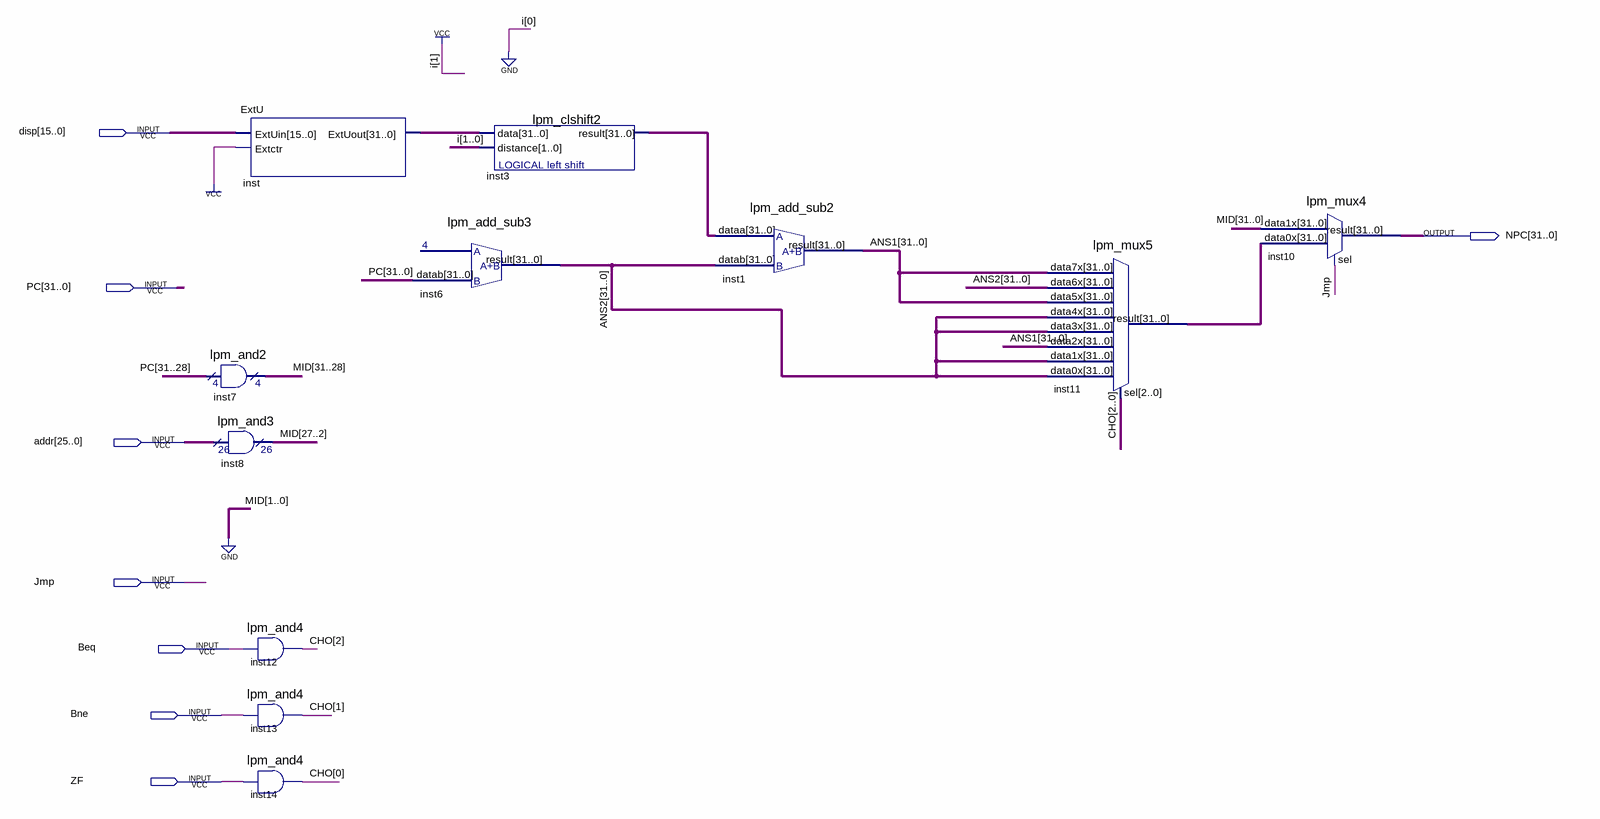
[diagram p0: schematic sheet]
// Quartus schematic ACU.bdf as structural Verilog: 11 symbols, 8 pins
module ACU (
  input  [15:0] disp,
  input  [31:0] PC,
  input  [25:0] addr,
  input  Jmp,
  input  Beq,
  input  Bne,
  input  ZF,
  output [31:0] NPC
);

  wire [2:0] CHO;
  wire [31:0] ANS1, ANS2, inst3_result, inst11_result, inst_extuout;
  wire [31:2] MID;

  lpm_and2 inst7 (.data0x(PC[31:28]), .result(MID[31:28]));
  lpm_and3 inst8 (.data0x(addr), .result(MID[27:2]));
  ExtU inst (.ExtUin(disp), .Extctr(1'b1), .ExtUout(inst_extuout));
  lpm_and4 inst12 (.data0(Beq), .result(CHO[2]));
  lpm_and4 inst13 (.data0(Bne), .result(CHO[1]));
  lpm_and4 inst14 (.data0(ZF), .result(CHO[0]));
  lpm_add_sub3 inst6 (.datab(PC), .result(ANS2));
  lpm_clshift2 inst3 (.data(inst_extuout), .distance(2'b10), .result(inst3_result));
  lpm_add_sub2 inst1 (.dataa(inst3_result), .datab(ANS2), .result(ANS1));
  lpm_mux5 inst11 (
    .data7x(ANS1), .data6x(ANS2), .data5x(ANS1), .data4x(ANS2), .data3x(ANS2), .data2x(ANS1), .data1x(ANS2),
    .data0x(ANS2), .sel(CHO), .result(inst11_result));
  lpm_mux4 inst10 (.data1x({MID, 2'b00}), .data0x(inst11_result), .sel(Jmp), .result(NPC));
endmodule
